# EAGLE design Examples (EAGLE 9.0.1)

## Sheet 1 of 4: Routing - Two PLTH Parts
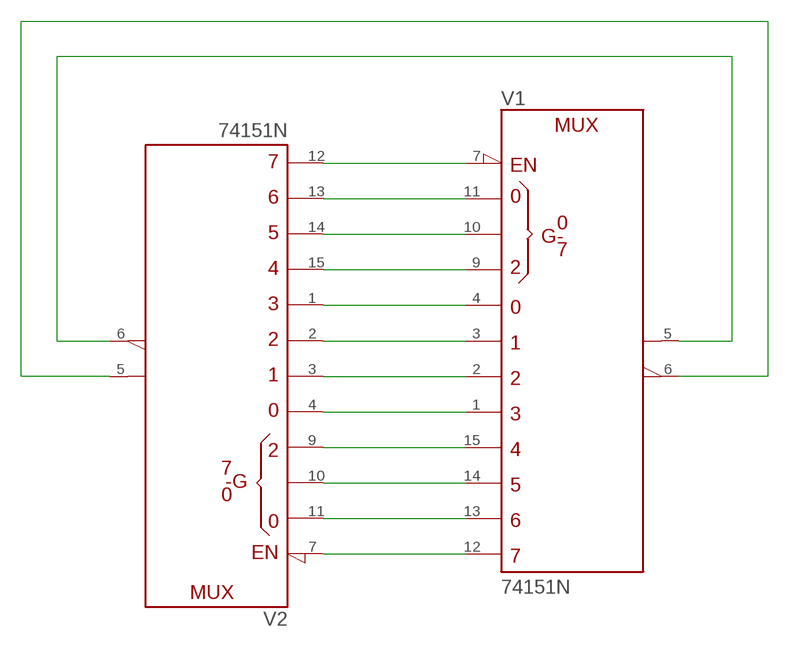
[diagram p0: schematic, sheet 1]

### Parts
V1  74151N  [DIL16]
V2  74151N  [DIL16]

### Nets
N$1: V1.7(!G) V2.12(D7)
N$2: V1.11(A) V2.13(D6)
N$3: V1.10(B) V2.14(D5)
N$4: V1.9(C) V2.15(D4)
N$5: V1.4(D0) V2.1(D3)
N$6: V1.3(D1) V2.2(D2)
N$7: V1.2(D2) V2.3(D1)
N$8: V1.1(D3) V2.4(D0)
N$9: V1.15(D4) V2.9(C)
N$10: V1.14(D5) V2.10(B)
N$11: V1.13(D6) V2.11(A)
N$12: V1.12(D7) V2.7(!G)
N$13: V1.5(Y) V2.6(W)
N$14: V1.6(W) V2.5(Y)

## Sheet 2 of 4: Design Blocks 101
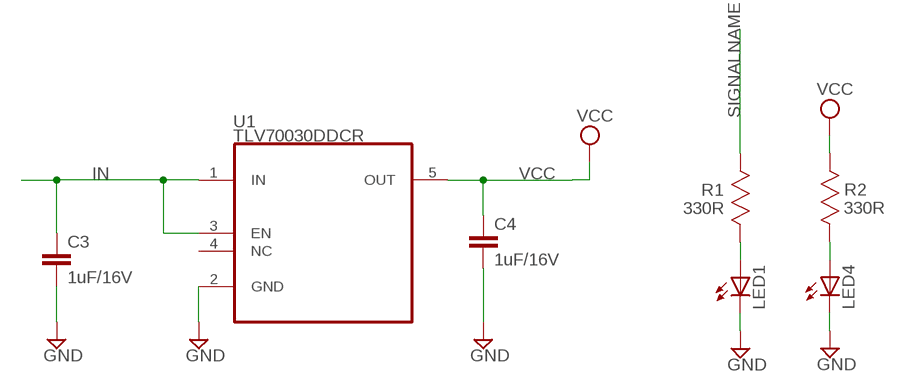
[diagram p1: schematic, sheet 2]

### Parts
C3  1uF/16V  C-EUC0603  [C0603]
C4  1uF/16V  C-EUC0603  [C0603]
LED1  LEDCHIP-LED0603  [CHIP-LED0603]
LED4  LEDCHIP-LED0603  [CHIP-LED0603]
R1  330R  MC0.063W06031%330R  [RESC1608X60N]
R2  330R  MC0.063W06031%330R  [RESC1608X60N]
U1  TLV70030DDCR  [SOT95P280X110-5]

### Nets
GND: C3.2 C4.2 LED1.C LED4.C U1.2(GND) ; also sheet 3
IN: C3.1 U1.1(IN) U1.3(EN)
N$16: LED1.A R1.2(R2)
N$17: LED4.A R2.2(R2)
SIGNALNAME: R1.1(R1)
VCC: C4.1 R2.1(R1) U1.5(OUT) ; also sheet 3
Unconnected: U1.4(NC)

## Sheet 3 of 4: Part Placement & Cleanup
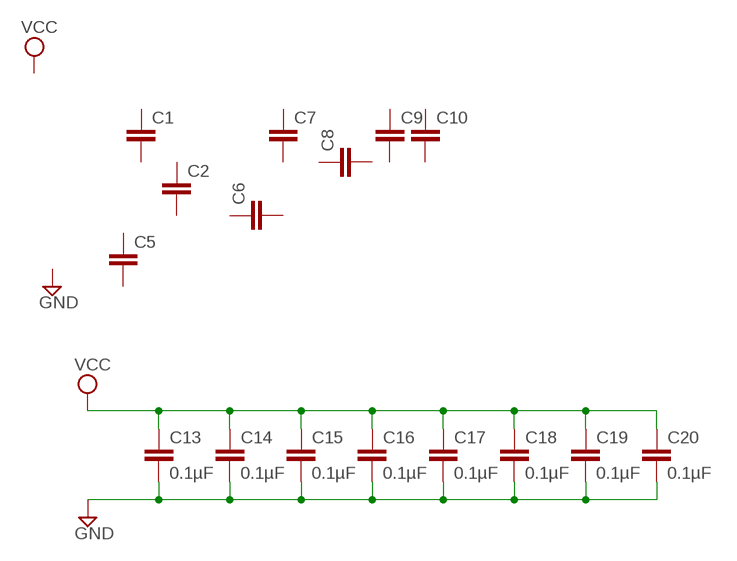
[diagram p2: schematic, sheet 3]

### Parts
C1  C-EUC0603  [C0603]
C2  C-EUC0603  [C0603]
C5  C-EUC0603  [C0603]
C6  C-EUC0603  [C0603]
C7  C-EUC0603  [C0603]
C8  C-EUC0603  [C0603]
C9  C-EUC0603  [C0603]
C10  C-EUC0603  [C0603]
C13  0.1µF  C-EUC0603  [C0603]
C14  0.1µF  C-EUC0603  [C0603]
C15  0.1µF  C-EUC0603  [C0603]
C16  0.1µF  C-EUC0603  [C0603]
C17  0.1µF  C-EUC0603  [C0603]
C18  0.1µF  C-EUC0603  [C0603]
C19  0.1µF  C-EUC0603  [C0603]
C20  0.1µF  C-EUC0603  [C0603]

### Nets
GND: C13.2 C14.2 C15.2 C16.2 C17.2 C18.2 C19.2 C20.2 ; also sheet 2
VCC: C13.1 C14.1 C15.1 C16.1 C17.1 C18.1 C19.1 C20.1 ; also sheet 2
Unconnected: C1.1 C1.2 C2.1 C2.2 C5.1 C5.2 C6.1 C6.2 C7.1 C7.2 C8.1 C8.2 C9.1 C9.2 C10.1 C10.2

## Sheet 4 of 4: Buses and Breakouts
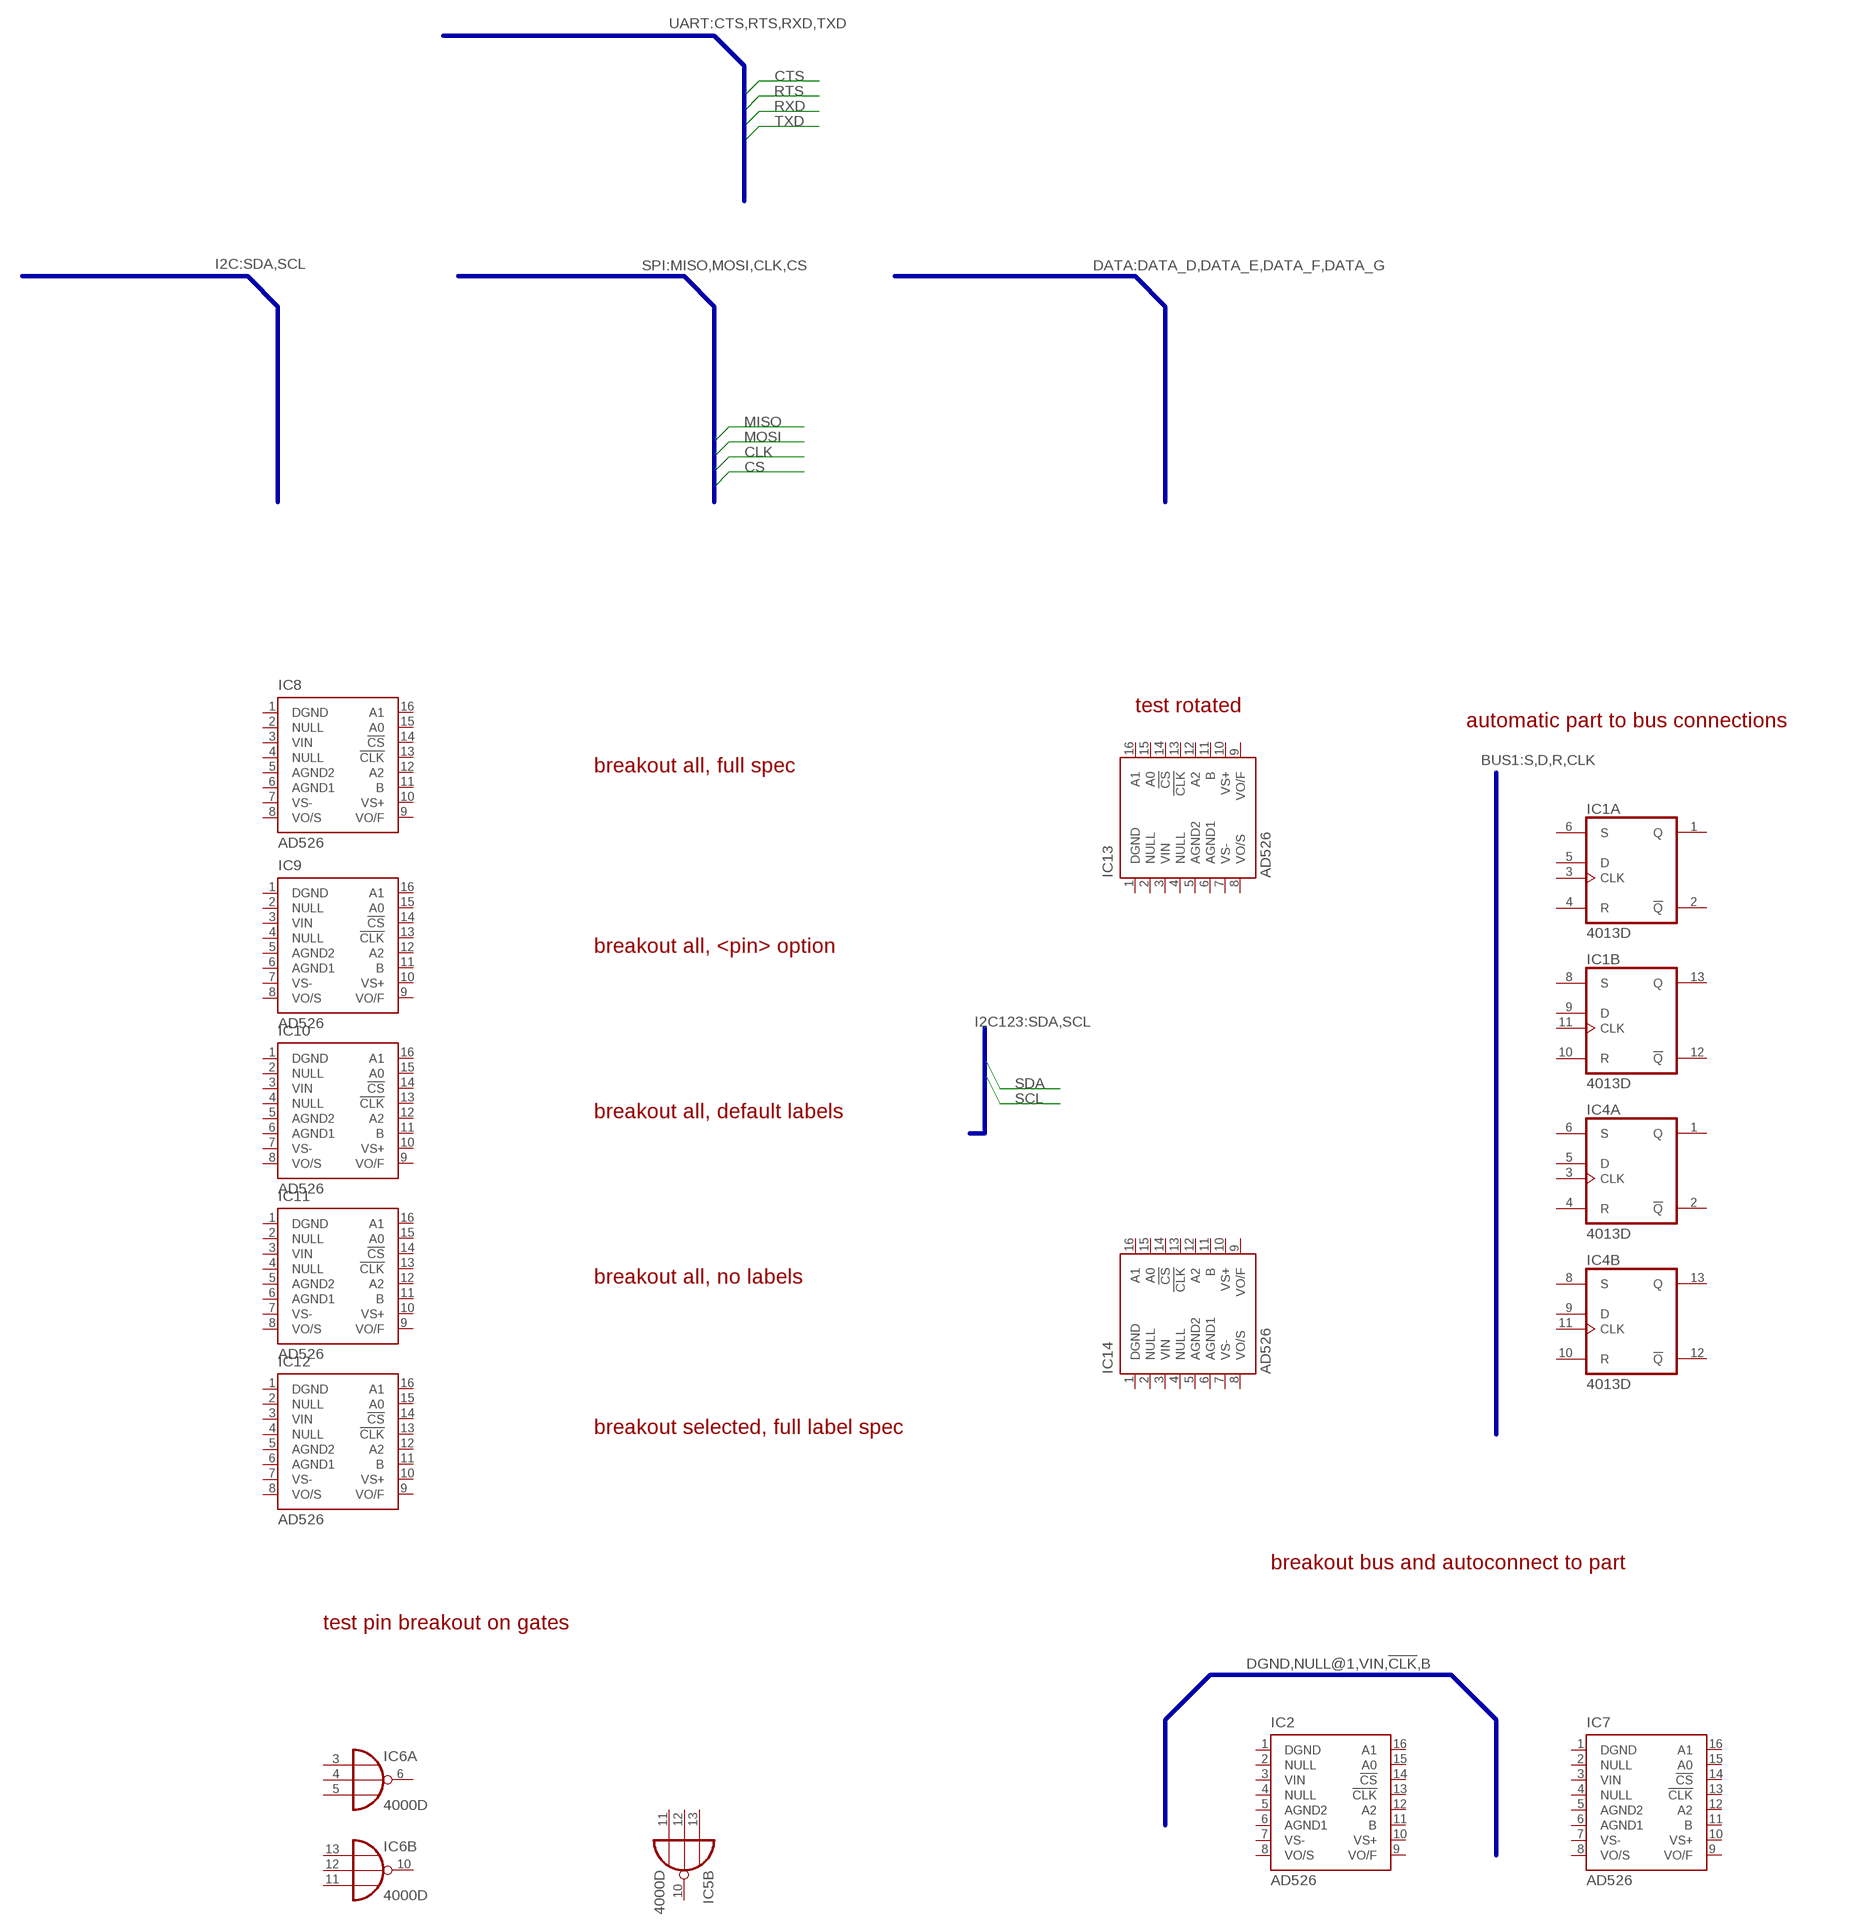
[diagram p3: schematic, sheet 4, part 1 of 2]
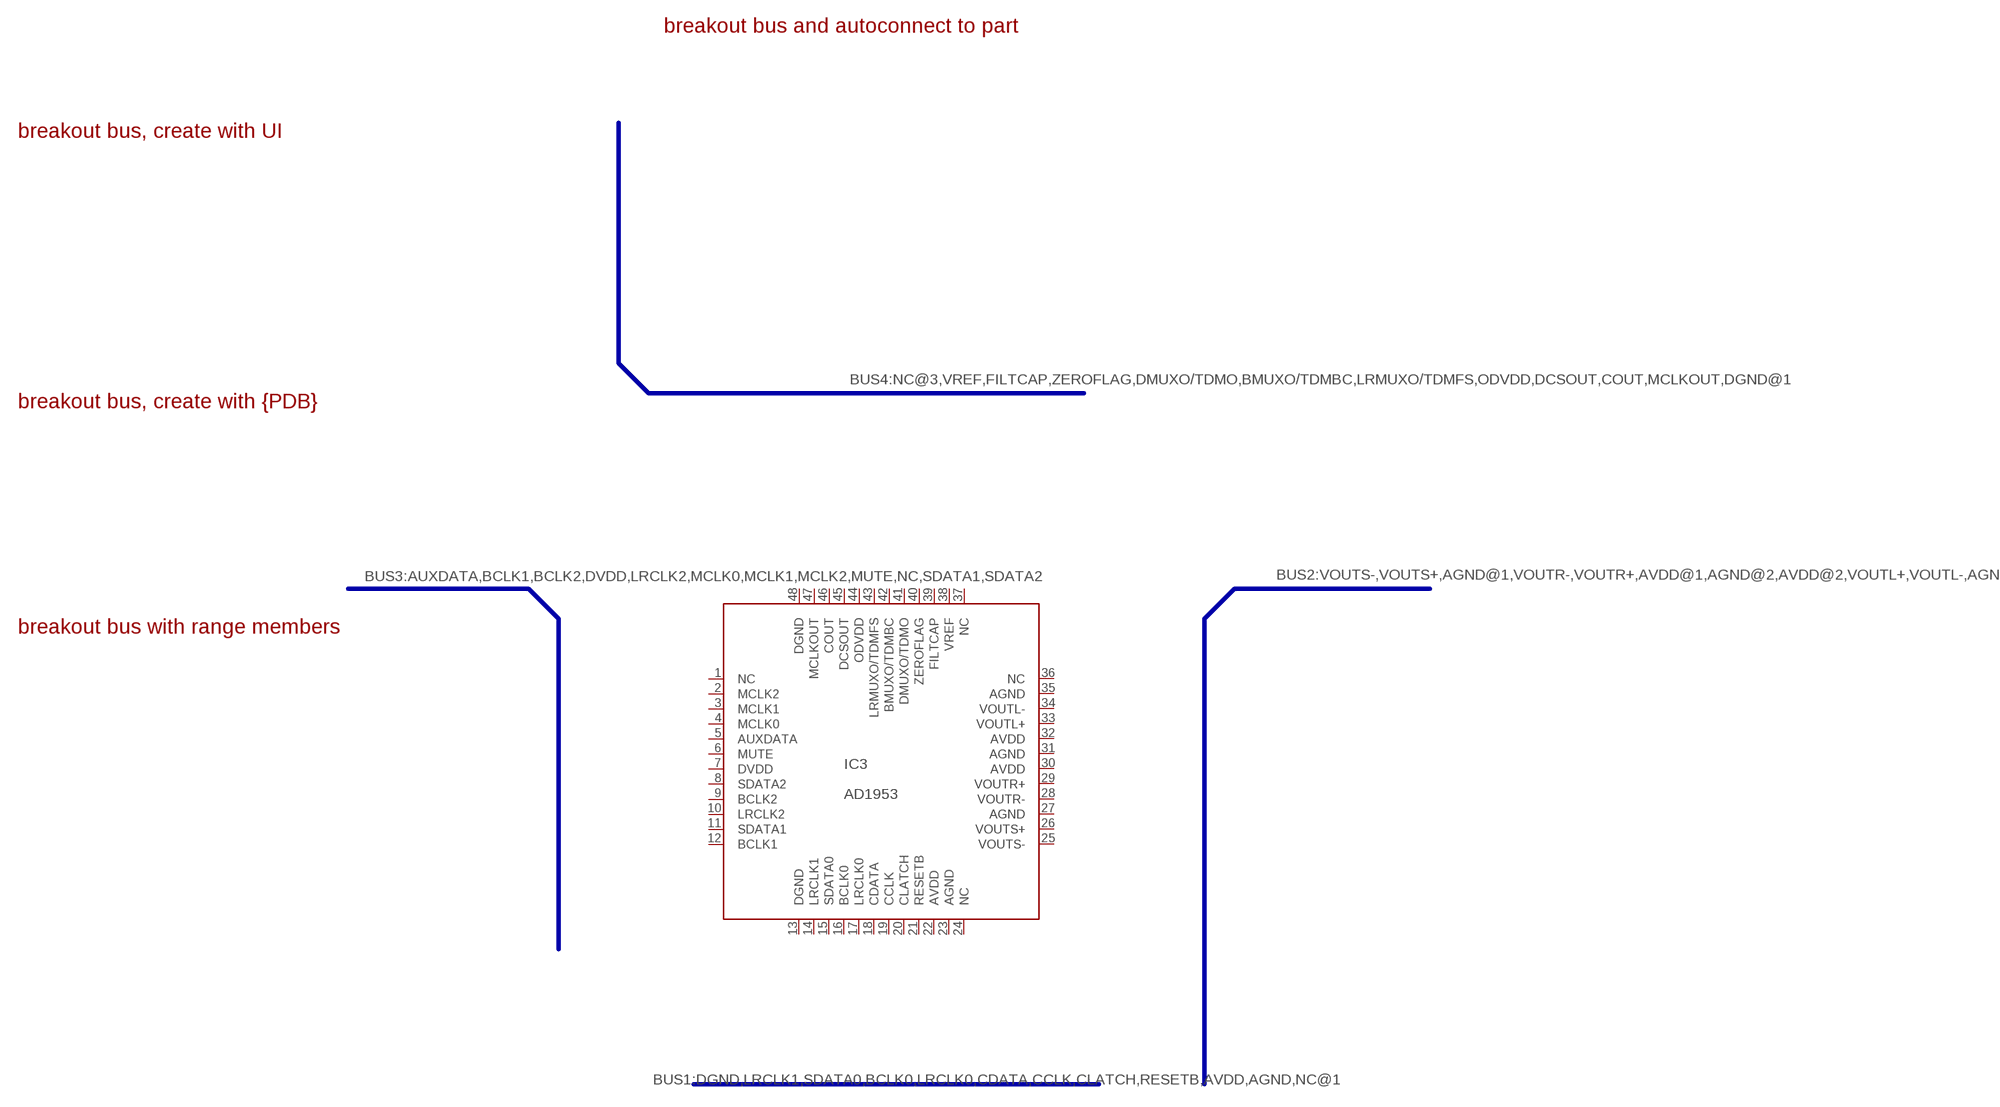
[diagram p4: schematic, sheet 4, part 2 of 2]

### Parts
IC1  4013D  [SO14]
IC2  AD526  [DIL16]
IC3  AD1953  [QFP-7X7-48]
IC4  4013D  [SO14]
IC5  4000D  [SO14]
IC6  4000D  [SO14]
IC7  AD526  [DIL16]
IC8  AD526  [DIL16]
IC9  AD526  [DIL16]
IC10  AD526  [DIL16]
IC11  AD526  [DIL16]
IC12  AD526  [DIL16]
IC13  AD526  [DIL16]
IC14  AD526  [DIL16]
Unconnected: IC1.1(A:Q) IC1.2(A:!Q) IC1.3(A:CLK) IC1.4(A:R) IC1.5(A:D) IC1.6(A:S) IC1.8(B:S) IC1.9(B:D) IC1.10(B:R) IC1.11(B:CLK) IC1.12(B:!Q) IC1.13(B:Q) IC2.1(DGND) IC2.2(NULL) IC2.3(VIN) IC2.4(NULL) IC2.5(AGND2) IC2.6(AGND1) IC2.7(VS-) IC2.8(VO/S) IC2.9(VO/F) IC2.10(VS+) IC2.11(B) IC2.12(A2) IC2.13(!CLK) IC2.14(!CS) IC2.15(A0) IC2.16(A1) IC3.1(NC) IC3.2(MCLK2) IC3.3(MCLK1) IC3.4(MCLK0) IC3.5(AUXDATA) IC3.6(MUTE) IC3.8(SDATA2) IC3.9(BCLK2) IC3.10(LRCLK2) IC3.11(SDATA1) IC3.12(BCLK1) IC3.14(LRCLK1) IC3.15(SDATA0) IC3.16(BCLK0) IC3.17(LRCLK0) IC3.18(CDATA) IC3.19(CCLK) IC3.20(CLATCH) IC3.21(RESETB) IC3.24(NC) IC3.25(VOUTS-) IC3.26(VOUTS+) IC3.28(VOUTR-) IC3.29(VOUTR+) IC3.33(VOUTL+) IC3.34(VOUTL-) IC3.36(NC) IC3.37(NC) IC3.38(VREF) IC3.39(FILTCAP) IC3.40(ZEROFLAG) IC3.41(DMUXO/TDMO) IC3.42(BMUXO/TDMBC) IC3.43(LRMUXO/TDMFS) IC3.45(DCSOUT) IC3.46(COUT) IC3.47(MCLKOUT) IC4.1(A:Q) IC4.2(A:!Q) IC4.3(A:CLK) IC4.4(A:R) IC4.5(A:D) IC4.6(A:S) IC4.8(B:S) IC4.9(B:D) IC4.10(B:R) IC4.11(B:CLK) IC4.12(B:!Q) IC4.13(B:Q) IC5.3(A:I0) IC5.4(A:I1) IC5.5(A:I2) IC5.6(A:O) IC5.8(C:I) IC5.9(C:O) IC5.10(B:O) IC5.11(B:I2) IC5.12(B:I1) IC5.13(B:I0) IC6.3(A:I0) IC6.4(A:I1) IC6.5(A:I2) IC6.6(A:O) IC6.8(C:I) IC6.9(C:O) IC6.10(B:O) IC6.11(B:I2) IC6.12(B:I1) IC6.13(B:I0) IC7.1(DGND) IC7.2(NULL) IC7.3(VIN) IC7.4(NULL) IC7.5(AGND2) IC7.6(AGND1) IC7.7(VS-) IC7.8(VO/S) IC7.9(VO/F) IC7.10(VS+) IC7.11(B) IC7.12(A2) IC7.13(!CLK) IC7.14(!CS) IC7.15(A0) IC7.16(A1) IC8.1(DGND) IC8.2(NULL) IC8.3(VIN) IC8.4(NULL) IC8.5(AGND2) IC8.6(AGND1) IC8.7(VS-) IC8.8(VO/S) IC8.9(VO/F) IC8.10(VS+) IC8.11(B) IC8.12(A2) IC8.13(!CLK) IC8.14(!CS) IC8.15(A0) IC8.16(A1) IC9.1(DGND) IC9.2(NULL) IC9.3(VIN) IC9.4(NULL) IC9.5(AGND2) IC9.6(AGND1) IC9.7(VS-) IC9.8(VO/S) IC9.9(VO/F) IC9.10(VS+) IC9.11(B) IC9.12(A2) IC9.13(!CLK) IC9.14(!CS) IC9.15(A0) IC9.16(A1) IC10.1(DGND) IC10.2(NULL) IC10.3(VIN) IC10.4(NULL) IC10.5(AGND2) IC10.6(AGND1) IC10.7(VS-) IC10.8(VO/S) IC10.9(VO/F) IC10.10(VS+) IC10.11(B) IC10.12(A2) IC10.13(!CLK) IC10.14(!CS) IC10.15(A0) IC10.16(A1) IC11.1(DGND) IC11.2(NULL) IC11.3(VIN) IC11.4(NULL) IC11.5(AGND2) IC11.6(AGND1) IC11.7(VS-) IC11.8(VO/S) IC11.9(VO/F) IC11.10(VS+) IC11.11(B) IC11.12(A2) IC11.13(!CLK) IC11.14(!CS) IC11.15(A0) IC11.16(A1) IC12.1(DGND) IC12.2(NULL) IC12.3(VIN) IC12.4(NULL) IC12.5(AGND2) IC12.6(AGND1) IC12.7(VS-) IC12.8(VO/S) IC12.9(VO/F) IC12.10(VS+) IC12.11(B) IC12.12(A2) IC12.13(!CLK) IC12.14(!CS) IC12.15(A0) IC12.16(A1) IC13.1(DGND) IC13.2(NULL) IC13.3(VIN) IC13.4(NULL) IC13.5(AGND2) IC13.6(AGND1) IC13.7(VS-) IC13.8(VO/S) IC13.9(VO/F) IC13.10(VS+) IC13.11(B) IC13.12(A2) IC13.13(!CLK) IC13.14(!CS) IC13.15(A0) IC13.16(A1) IC14.1(DGND) IC14.2(NULL) IC14.3(VIN) IC14.4(NULL) IC14.5(AGND2) IC14.6(AGND1) IC14.7(VS-) IC14.8(VO/S) IC14.9(VO/F) IC14.10(VS+) IC14.11(B) IC14.12(A2) IC14.13(!CLK) IC14.14(!CS) IC14.15(A0) IC14.16(A1)

### Buses
BUS1:S,D,R,CLK
BUS1:DGND,LRCLK1,SDATA0,BCLK0,LRCLK0,CDATA,CCLK,CLATCH,RESETB,AVDD,AGND,NC@1
BUS2:VOUTS-,VOUTS+,AGND@1,VOUTR-,VOUTR+,AVDD@1,AGND@2,AVDD@2,VOUTL+,VOUTL-,AGND@3,NC@2
BUS3:AUXDATA,BCLK1,BCLK2,DVDD,LRCLK2,MCLK0,MCLK1,MCLK2,MUTE,NC,SDATA1,SDATA2
BUS4:NC@3,VREF,FILTCAP,ZEROFLAG,DMUXO/TDMO,BMUXO/TDMBC,LRMUXO/TDMFS,ODVDD,DCSOUT,COUT,MCLKOUT,DGND@1
DGND,NULL@1,VIN,!CLK,B
I2C:SDA,SCL
SPI:MISO,MOSI,CLK,CS
DATA:DATA_D,DATA_E,DATA_F,DATA_G
I2C123:SDA,SCL
UART:CTS,RTS,RXD,TXD

### Notes on the sheet
- breakout bus and autoconnect to part
- test rotated
- automatic part to bus connections
- breakout bus, create with UI
- breakout all, full spec
- breakout all, <pin> option
- breakout bus, create with {PDB}
- breakout all, default labels
- breakout bus with range members
- breakout all, no labels
- breakout selected, full label spec
- breakout bus and autoconnect to part
- test pin breakout on gates

## Power pins joined to a net without a drawn wire
+UB: V1.16(+UB) V2.16(+UB)
-UB: V1.8(-UB) V2.8(-UB)
AGND: IC3.23(AGND) IC3.27(AGND) IC3.31(AGND) IC3.35(AGND)
AVDD: IC3.22(AVDD) IC3.30(AVDD) IC3.32(AVDD)
DGND: IC3.13(DGND) IC3.48(DGND)
DVDD: IC3.7(DVDD)
ODVDD: IC3.44(ODVDD)
VDD: IC1.14(P:VDD) IC4.14(P:VDD) IC5.14(P:VDD) IC6.14(P:VDD)
VSS: IC1.7(P:VSS) IC4.7(P:VSS) IC5.7(P:VSS) IC6.7(P:VSS)

## Library data of the parts
C1 C2 C5-C10 C13-C20 = rcl:C-EU: CAPACITOR, European symbol; SPICEPREFIX: C
C3 C4 = rcl:C-EU: CAPACITOR, European symbol; DIGIKEY: 399-8001-1-ND; SPICEPREFIX: C
IC1 IC4 = 40xx:4013: Dual D FLIP FLOP, set/reset
IC2 IC7-IC14 = analog-devices:AD526: Monolithic Software Programmable Gain Amplifier Source: http://www.dscc.dla.mil/Downloads/MilSpec/Smd/90894.pdf; MF: ALTERA CORPORATION; MPN: AD526AD; OC_FARNELL: 402140; OC_NEWARK: 05F6913
IC3 = analog-devices:AD1953: SigmaDSP (TM) 3-Channel, 26-Bit Signal Processing DAC Auto generated by make-symbol-device-package-bsdl.ulp Rev. 33 Source: http://www.analog.com/static/imported-files/data_sheets/AD1953.pdf; MPN: AD1953YSTZRL7; OC_FARNELL: unknown; OC_NEWARK: 12M8457
IC5 IC6 = 40xx:4000: Dual 3-input NOR & INVERTER
LED1 LED4 = led:LED: LED OSRAM: - CHIPLED LG R971, LG N971, LY N971, LG Q971, LY Q971, LO R971, LY R971 LH N974, LH R974 LS Q976, LO Q976, LY Q976 LO Q996 - Hyper CHIPLED LW Q18S LB Q993, LB Q99A, LB R99A - SideLED LS A670, LO A670, LY A670, LG A670, LP A670 LB A673, LV A673, LT A673, LW A673 LH A674 LY A675 LS A676, LA A676, LO A676, LY A676, LW A676 LS A679, LY A679, LG A679 - Hyper Micro SIDELED® LS Y876, LA Y876, LO Y876, LY Y876 LT Y87S - SmartLED LW L88C, LW L88S LB L89C, LB L89S, LG L890 LS L89K, LO L89K, LY L89K LS L896, LA L896, LO L896, LY L896 - TOPLED LS T670, LO T670, LY T670, LG T670, LP T670 LSG T670, LSP T670, LSY T670, LOP T670, LYG T670 LG T671, LOG T671, LSG T671 LB T673, LV T673, LT T673, LW T673 LH T674 LS T676, LA T676, LO T676, LY T676, LB T676, LH T676, LSB T676, LW T676 LB T67C, LV T67C, LT T67C, LS T67K, LO T67K, LY T67K, LW E67C LS E67B, LA E67B, LO E67B, LY E67B, LB E67C, LV E67C, LT E67C LW T67C LS T679, LY T679, LG T679 LS T770, LO T770, LY T770, LG T770, LP T770 LB T773, LV T773, LT T773, LW T773 LH T774 LS E675, LA E675, LY E675, LS T675 LS T776, LA T776, LO T776, LY T776, LB T776 LHGB T686 LT T68C, LB T68C - Hyper Mini TOPLED® LB M676 - Mini TOPLED Santana® LG M470 LS M47K, LO M47K, LY M47K Source: http://www.osram.convergy.de LUXEON: - LUMILED® LXK2-PW12-R00, LXK2-PW12-S00, LXK2-PW14-U00, LXK2-PW14-V00 LXK2-PM12-R00, LXK2-PM12-S00, LXK2-PM14-U00 LXK2-PE12-Q00, LXK2-PE12-R00, LXK2-PE12-S00, LXK2-PE14-T00, LXK2-PE14-U00 LXK2-PB12-K00, LXK2-PB12-L00, LXK2-PB12-M00, LXK2-PB14-N00, LXK2-PB14-P00, LXK2-PB14-Q00 LXK2-PR12-L00, LXK2-PR12-M00, LXK2-PR14-Q00, LXK2-PR14-R00 LXK2-PD12-Q00, LXK2-PD12-R00, LXK2-PD12-S00 LXK2-PH12-R00, LXK2-PH12-S00 LXK2-PL12-P00, LXK2-PL12-Q00, LXK2-PL12-R00 Source: www.luxeon.com KINGBRIGHT: KA-3528ASYC Source: www.kingbright.com
R1 R2 = Multicomp:MC0.063W06031%330R: RESISTOR, 0603; MPN: MC0.063W06031%330R; OC_FARNELL: 9331018; OC_NEWARK: -; SUPPLIER: Multicomp; TOLERANCE: ±1%; VALUE: 330 Ohms; WATTAGE: 1/16 W
U1 = OLED Watch Original Library:TLV70030DDCR: TLV700xx-Q1 200-mA Low-IQ Low-Dropout Regulator for Portable Devices
V1 V2 = 74ttl-din:74*151: Data SELECTOR/MULTIPLEXER

## Board
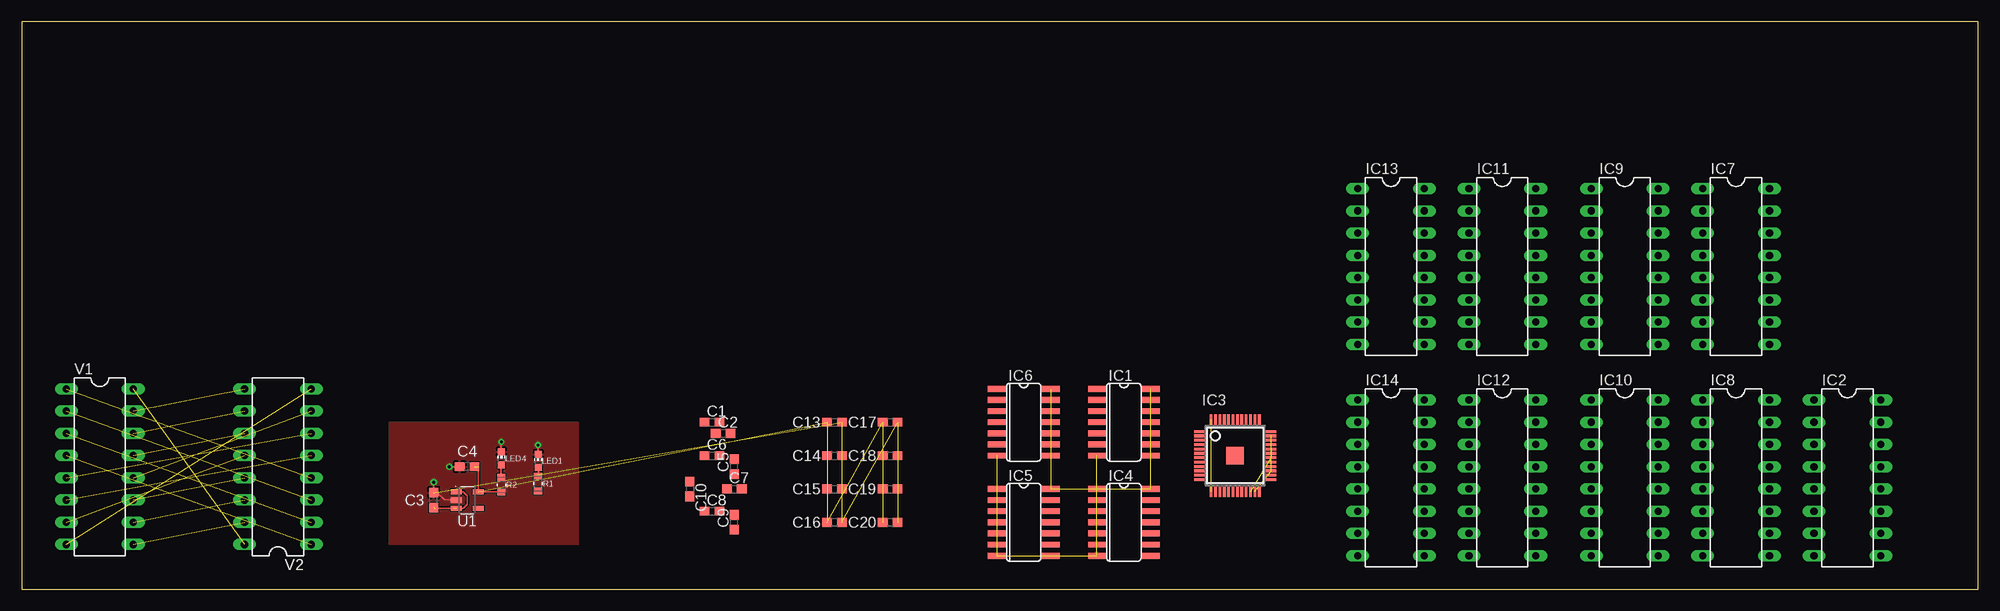
[diagram p5: board, top side]

Size 223.19 x 64.76 mm. Coordinates in mm from the lower left corner, seen from the top.
Outline: 0,0 223.19,0 223.19,64.76 0,64.76 0,0
Copper layers (1*16): Top 0.035mm / dielectric 1.5mm / Bottom 0.035mm
Design rules "default": minimum track width 6mil, minimum drill 0.35mm, track to track 6mil, track to pad 6mil, pad to pad 6mil, via to via 6mil, smd to smd 6mil, copper to edge 40mil, drill to drill 6mil, minimum pad ring 10mil, minimum via ring 8mil, stop-mask expansion 4mil, vias tented up to drill 0mil, thermal gap 10mil

### Footprints (pad centres in the part's own frame; a part is rotated, then mirrored left to right if it is on the bottom)
C0603 = smd 1.1 x 1: 1 -0.85,0; 2 0.85,0
SO14 = smd 0.66 x 2.032: 1 -3.81,-3.073; 2 -2.54,-3.073; 3 -1.27,-3.073; 4 0,-3.073; 5 1.27,-3.073; 6 2.54,-3.073; 7 3.81,-3.073; 8 3.81,3.073; 9 2.54,3.073; 10 1.27,3.073; 11 0,3.073; 12 -1.27,3.073; 13 -2.54,3.073; 14 -3.81,3.073
DIL16 = drill 0.813 long: 1 -8.89,-3.81; 2 -6.35,-3.81; 3 -3.81,-3.81; 4 -1.27,-3.81; 5 1.27,-3.81; 6 3.81,-3.81; 7 6.35,-3.81; 8 8.89,-3.81; 9 8.89,3.81; 10 6.35,3.81; 11 3.81,3.81; 12 1.27,3.81; 13 -1.27,3.81; 14 -3.81,3.81; 15 -6.35,3.81; 16 -8.89,3.81
QFP-7X7-48 = smd 0.3 x 1.2: 1 -2.75,-4.1; 2 -2.25,-4.1; 3 -1.75,-4.1; 4 -1.25,-4.1; 5 -0.75,-4.1; 6 -0.25,-4.1; 7 0.25,-4.1; 8 0.75,-4.1; 9 1.25,-4.1; 10 1.75,-4.1; 11 2.25,-4.1; 12 2.75,-4.1; 25 2.75,4.1; 26 2.25,4.1; 27 1.75,4.1; 28 1.25,4.1; 29 0.75,4.1; 30 0.25,4.1; 31 -0.25,4.1; 32 -0.75,4.1; 33 -1.25,4.1; 34 -1.75,4.1; 35 -2.25,4.1; 36 -2.75,4.1 | smd 1.2 x 0.3: 13 4.1,-2.75; 14 4.1,-2.25; 15 4.1,-1.75; 16 4.1,-1.25; 17 4.1,-0.75; 18 4.1,-0.25; 19 4.1,0.25; 20 4.1,0.75; 21 4.1,1.25; 22 4.1,1.75; 23 4.1,2.25; 24 4.1,2.75; 37 -4.1,2.75; 38 -4.1,2.25; 39 -4.1,1.75; 40 -4.1,1.25; 41 -4.1,0.75; 42 -4.1,0.25; 43 -4.1,-0.25; 44 -4.1,-0.75; 45 -4.1,-1.25; 46 -4.1,-1.75; 47 -4.1,-2.25; 48 -4.1,-2.75 | smd 2 x 2: EXP 0,0
CHIP-LED0603 = smd 0.8 x 0.8: A 0,-0.75; C 0,0.75
RESC1608X60N = smd 0.762 x 0.94: 1 -0.838,0; 2 0.838,0
SOT95P280X110-5 = smd 1.25 x 0.589: 1 -1.256,0.95; 2 -1.256,0; 3 -1.256,-0.95; 4 1.256,-0.95; 5 1.256,0.95

### Placement (x,y rotation side)
C1  78.74,19.05 0 top
C2  80.01,17.78 0 top
C3  46.99,10.16 90 top
C4  50.8,13.97 180 top
C5  81.28,13.97 90 top
C6  78.74,15.24 0 top
C7  81.28,11.43 0 top
C8  78.74,8.89 0 top
C9  81.28,7.62 90 top
C10  76.2,11.43 270 top
C13  92.71,19.05 0 top
C14  92.71,15.24 0 top
C15  92.71,11.43 0 top
C16  92.71,7.62 0 top
C17  99.06,19.05 0 top
C18  99.06,15.24 0 top
C19  99.06,11.43 0 top
C20  99.06,7.62 0 top
IC1  125.73,19.05 270 top
IC2  208.28,12.7 270 top
IC3  138.43,15.24 270 top
IC4  125.73,7.62 270 top
IC5  114.3,7.62 270 top
IC6  114.3,19.05 270 top
IC7  195.58,36.83 270 top
IC8  195.58,12.7 270 top
IC9  182.88,36.83 270 top
IC10  182.88,12.7 270 top
IC11  168.91,36.83 270 top
IC12  168.91,12.7 270 top
IC13  156.21,36.83 270 top
IC14  156.21,12.7 270 top
LED1  58.89,14.64 0 top
LED4  54.7,14.91 0 top
R1  58.89,12.04 90 top
R2  54.7,11.91 90 top
U1  50.8,10.16 0 top
V1  8.89,13.97 270 top
V2  29.21,13.97 90 top

### Tracks (layer width: path | path; a pad name or v marks a point on that pad's centre or on a via)
+UB  (1 unrouted)
-UB  (1 unrouted)
AGND  (3 unrouted)
AVDD  (2 unrouted)
DGND  (1 unrouted)
GND  (via drill 0.3, 0.35)  (8 unrouted)
  Top 0.152: 47.41,11.01 48.26,10.16 U1.2 | C4.2 v48.77,13.97 | C3.2 v46.99,12.19
  Top 0.254: LED1.C v58.89,16.44 | LED4.C v54.7,16.81
  pour Top: 41.91,5.08 41.91,19.05 63.5,19.05 63.5,5.08
IN  (2 unrouted)
  Top 0.152: 47.09,9.21 49.28,9.21 50.36,9.21 50.8,9.65 50.8,9.91 50.8,10.67 50.36,11.11 U1.1
N$1  (1 unrouted)
N$2  (1 unrouted)
N$3  (1 unrouted)
N$4  (1 unrouted)
N$5  (1 unrouted)
N$6  (1 unrouted)
N$7  (1 unrouted)
N$8  (1 unrouted)
N$9  (1 unrouted)
N$10  (1 unrouted)
N$11  (1 unrouted)
N$12  (1 unrouted)
N$13  (1 unrouted)
N$14  (1 unrouted)
N$16
  Top 0.254: LED1.A R1.2
N$17
  Top 0.254: R2.2 LED4.A
VCC  (9 unrouted)
  Top 0.152: 52.06,13.97 U1.5 54.66,11.11 R2.1
VDD  (3 unrouted)
VSS  (3 unrouted)